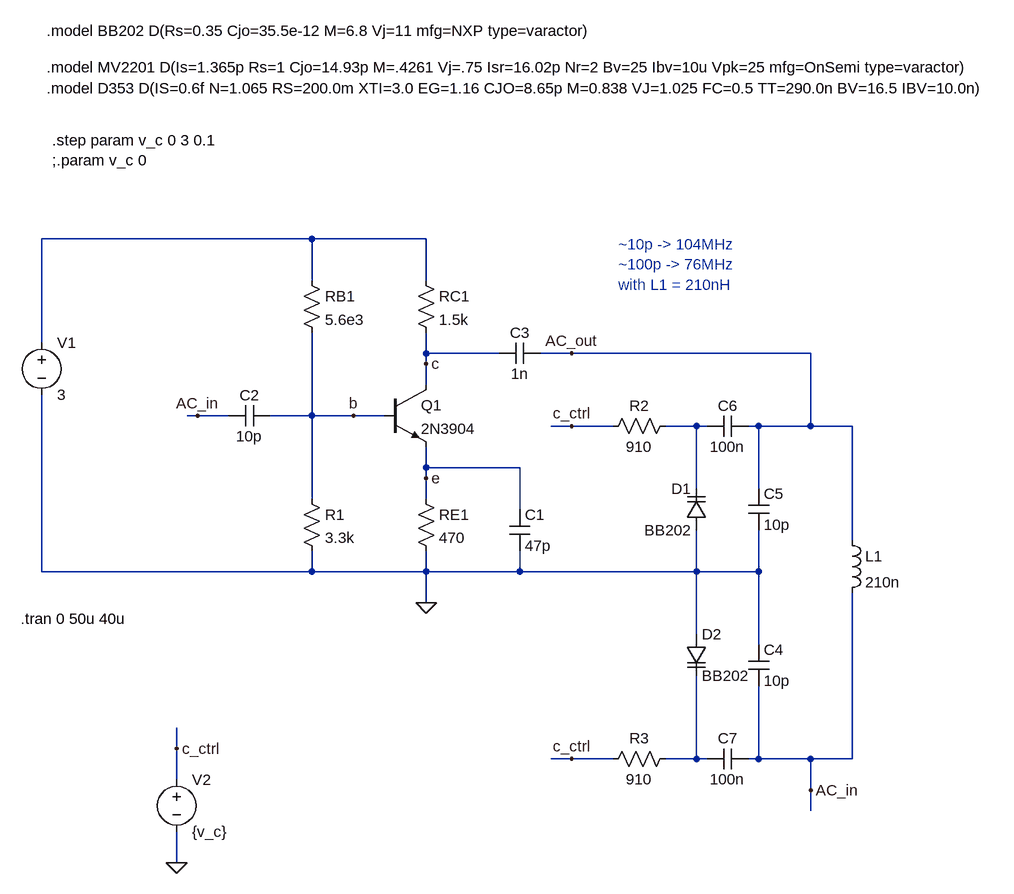
[diagram p0: schematic 02-Common_self-biasing_varactor.asc]
02-Common_self-biasing_varactor.asc, the LTspice schematic file:
Version 4
SHEET 1 1412 804
WIRE 176 -176 -240 -176
WIRE 352 -176 176 -176
WIRE 176 -112 176 -176
WIRE 352 -112 352 -176
WIRE -240 -16 -240 -176
WIRE 352 0 352 -32
WIRE 464 0 352 0
WIRE 576 0 528 0
WIRE 944 0 576 0
WIRE 352 16 352 0
WIRE 352 48 352 16
WIRE 0 96 -16 96
WIRE 48 96 0 96
WIRE 176 96 176 -32
WIRE 176 96 112 96
WIRE 240 96 176 96
WIRE 288 96 240 96
WIRE 576 112 544 112
WIRE 640 112 576 112
WIRE 768 112 720 112
WIRE 784 112 768 112
WIRE 864 112 848 112
WIRE 944 112 944 0
WIRE 944 112 864 112
WIRE 1008 112 944 112
WIRE 352 176 352 144
WIRE 496 176 352 176
WIRE 352 192 352 176
WIRE 768 208 768 112
WIRE 864 208 864 112
WIRE 176 224 176 96
WIRE 352 224 352 192
WIRE 496 240 496 176
WIRE 1008 288 1008 112
WIRE -240 336 -240 64
WIRE 176 336 176 304
WIRE 176 336 -240 336
WIRE 352 336 352 304
WIRE 352 336 176 336
WIRE 496 336 496 304
WIRE 496 336 352 336
WIRE 768 336 768 272
WIRE 768 336 496 336
WIRE 864 336 864 272
WIRE 864 336 768 336
WIRE 352 384 352 336
WIRE 768 432 768 336
WIRE 864 448 864 336
WIRE -32 608 -32 576
WIRE 576 624 544 624
WIRE 640 624 576 624
WIRE 768 624 768 496
WIRE 768 624 720 624
WIRE 784 624 768 624
WIRE 864 624 864 512
WIRE 864 624 848 624
WIRE 944 624 864 624
WIRE 1008 624 1008 368
WIRE 1008 624 944 624
WIRE -32 656 -32 608
WIRE 944 672 944 624
WIRE 944 704 944 672
WIRE -32 784 -32 736
FLAG 352 192 e
FLAG 352 16 c
FLAG 352 384 0
FLAG 240 96 b
FLAG 0 96 AC_in
FLAG 576 0 AC_out
FLAG 944 672 AC_in
FLAG -32 784 0
FLAG -32 608 c_ctrl
FLAG 576 112 c_ctrl
FLAG 576 624 c_ctrl
SYMBOL voltage -240 -32 R0
WINDOW 123 0 0 Left 0
WINDOW 39 0 0 Left 0
SYMATTR InstName V1
SYMATTR Value 3
SYMBOL res 336 -128 R0
SYMATTR InstName RC1
SYMATTR Value 1.5k
SYMBOL npn 288 48 R0
SYMATTR InstName Q1
SYMATTR Value 2N3904
SYMBOL res 336 208 R0
SYMATTR InstName RE1
SYMATTR Value 470
SYMBOL res 160 -128 R0
SYMATTR InstName RB1
SYMATTR Value 5.6e3
SYMBOL res 160 208 R0
SYMATTR InstName R1
SYMATTR Value 3.3k
SYMBOL cap 480 240 R0
SYMATTR InstName C1
SYMATTR Value 47p
SYMBOL cap 112 80 R90
WINDOW 0 0 32 VBottom 2
WINDOW 3 32 32 VTop 2
SYMATTR InstName C2
SYMATTR Value 10p
SYMBOL cap 528 -16 R90
WINDOW 0 0 32 VBottom 2
WINDOW 3 32 32 VTop 2
SYMATTR InstName C3
SYMATTR Value 1n
SYMBOL ind 992 272 R0
SYMATTR InstName L1
SYMATTR Value 210n
SYMBOL cap 848 448 R0
SYMATTR InstName C4
SYMATTR Value 10p
SYMBOL cap 848 208 R0
SYMATTR InstName C5
SYMATTR Value 10p
SYMBOL voltage -32 640 R0
WINDOW 123 0 0 Left 0
WINDOW 39 0 0 Left 0
SYMATTR InstName V2
SYMATTR Value {v_c}
SYMBOL res 736 96 R90
WINDOW 0 0 56 VBottom 2
WINDOW 3 32 56 VTop 2
SYMATTR InstName R2
SYMATTR Value 910
SYMBOL res 736 608 R90
WINDOW 0 0 56 VBottom 2
WINDOW 3 32 56 VTop 2
SYMATTR InstName R3
SYMATTR Value 910
SYMBOL varactor 784 272 R180
WINDOW 0 24 64 Left 2
WINDOW 3 24 0 Left 2
SYMATTR InstName D1
SYMATTR Value BB202
SYMBOL varactor 752 432 R0
SYMATTR InstName D2
SYMATTR Value BB202
SYMBOL cap 848 96 R90
WINDOW 0 0 32 VBottom 2
WINDOW 3 32 32 VTop 2
SYMATTR InstName C6
SYMATTR Value 100n
SYMBOL cap 848 608 R90
WINDOW 0 0 32 VBottom 2
WINDOW 3 32 32 VTop 2
SYMATTR InstName C7
SYMATTR Value 100n
TEXT -272 408 Left 2 !.tran 0 50u 40u
TEXT -232 -440 Left 2 !.model MV2201 D(Is=1.365p Rs=1 Cjo=14.93p M=.4261 Vj=.75 Isr=16.02p Nr=2 Bv=25 Ibv=10u Vpk=25 mfg=OnSemi type=varactor)
TEXT -224 -328 Left 2 !.step param v_c 0 3 0.1\n;.param v_c 0
TEXT -232 -408 Left 2 !.model D353 D(IS=0.6f N=1.065 RS=200.0m XTI=3.0 EG=1.16 CJO=8.65p M=0.838 VJ=1.025 FC=0.5 TT=290.0n BV=16.5 IBV=10.0n)
TEXT 648 -168 Left 2 ;~10p -> 104MHz\n~100p -> 76MHz\nwith L1 = 210nH
TEXT -232 -496 Left 2 !.model BB202 D(Rs=0.35 Cjo=35.5e-12 M=6.8 Vj=11 mfg=NXP type=varactor)

The netlist it stands for:
* 02-Common_self-biasing_varactor.asc
V1 N001 0 3
RC1 N001 c 1.5k
Q1 c b e 0 2N3904
RE1 e 0 470
RB1 N001 b 5.6e3
R1 b 0 3.3k
C1 e 0 47p
C2 b AC_in 10p
C3 AC_out c 1n
L1 AC_out AC_in 210n
C4 0 AC_in 10p
C5 AC_out 0 10p
V2 c_ctrl 0 {v_c}
R2 N002 c_ctrl 910
R3 N003 c_ctrl 910
D1 0 N002 BB202
D2 0 N003 BB202
C6 AC_out N002 100n
C7 AC_in N003 100n
.model D D
.lib standard.dio
.model NPN NPN
.model PNP PNP
.lib standard.bjt
.tran 0 50u 40u
.model MV2201 D(Is=1.365p Rs=1 Cjo=14.93p M=.4261 Vj=.75 Isr=16.02p Nr=2 Bv=25 Ibv=10u Vpk=25 mfg=OnSemi type=varactor)
.step param v_c 0 3 0.1
;.param v_c 0
.model D353 D(IS=0.6f N=1.065 RS=200.0m XTI=3.0 EG=1.16 CJO=8.65p M=0.838 VJ=1.025 FC=0.5 TT=290.0n BV=16.5 IBV=10.0n)
* ~10p -> 104MHz
* ~100p -> 76MHz
* with L1 = 210nH
.model BB202 D(Rs=0.35 Cjo=35.5e-12 M=6.8 Vj=11 mfg=NXP type=varactor)
.backanno
.end